# Altium schematic sheet FPGA.SchDoc: Cypress Molson - FPGA's
size B; ApprovedBy: G. Cosens; CheckedBy: G.Cosens; Author: G. Cosens; CompanyName: Linear Systems Ltd.; DrawnBy: G. Cosens; Engineer: G. Cosens; Organization: Linear Systems Ltd.; Address1: 1717 Dublin Avenue, Unit 1; Address2: Winnipeg, MB, Canada; Address3: R3H 0H2; DocumentNumber: LS7652; Revision: 1; SheetNumber: 03; SheetTotal: 12
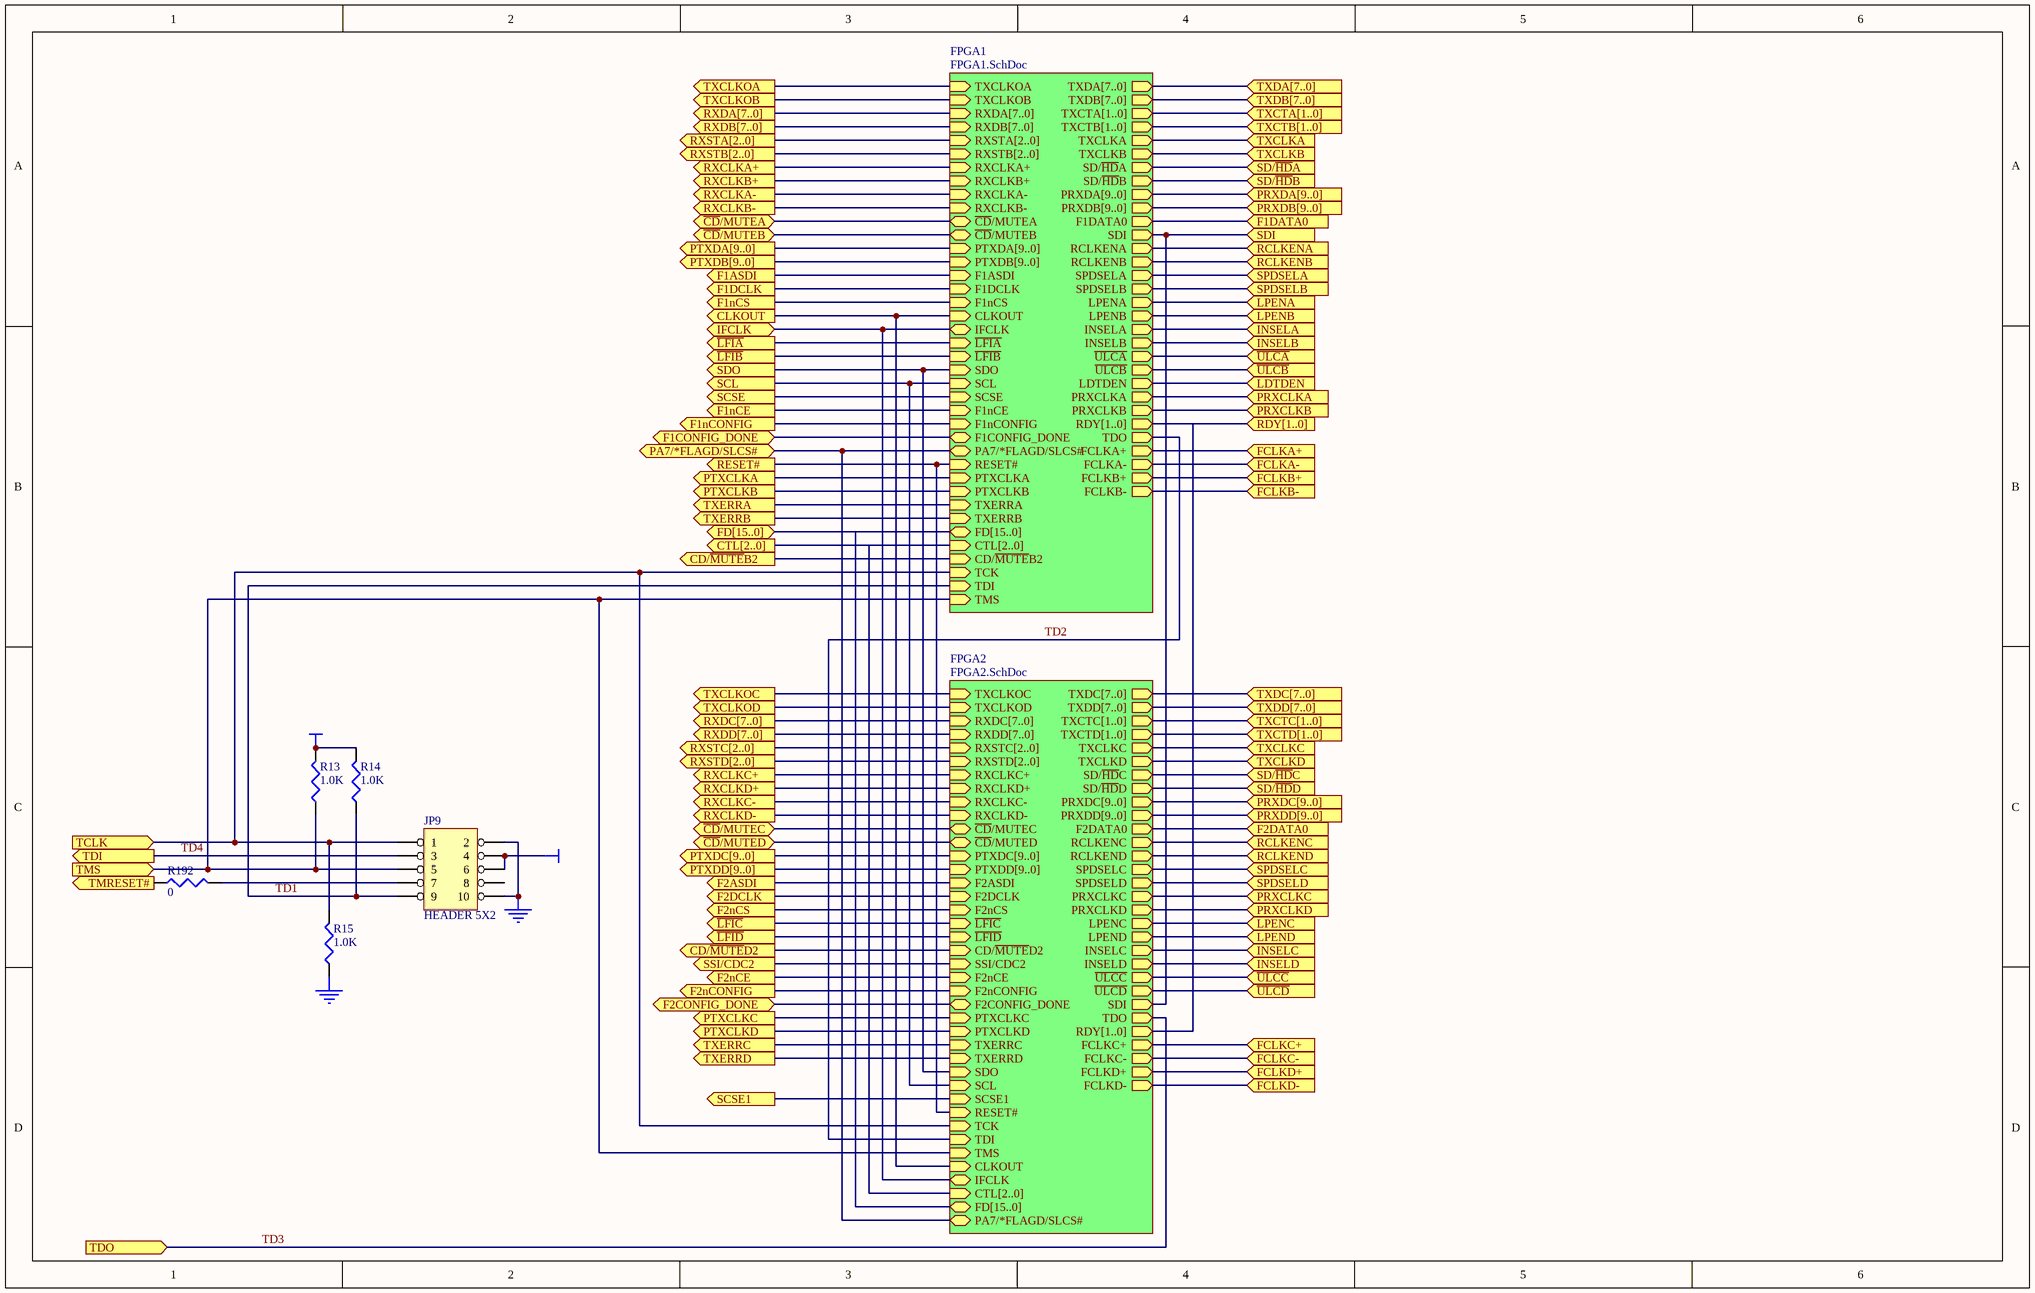
[diagram p0: FPGA.SchDoc]

## Parts
JP9  (no value)  [2X5PIN]
R13  1.0K  [0603]
R14  1.0K  [0603]
R15  1.0K  [0603]
R192  0  [0603]

## Sub-sheets
FPGA1 = FPGA1.SchDoc: TXDA[7..0] (out), TXDB[7..0] (out), TXCTA[1..0] (out), TXCTB[1..0] (out), TXCLKOA (in), TXCLKOB (in), TXCLKA (out), TXCLKB (out), RXDA[7..0] (in), RXDB[7..0] (in), RXSTA[2..0] (in), RXSTB[2..0] (in), RXCLKA+ (in), RXCLKB+ (in), RXCLKA- (in), RXCLKB- (in), SD/~{HD}A (out), SD/~{HD}B (out), ~{CD}/MUTEA (bidir), ~{CD}/MUTEB (bidir), PTXDA[9..0] (in), PTXDB[9..0] (in), PRXDA[9..0] (out), PRXDB[9..0] (out), F1DATA0 (out), F1ASDI (in), F1DCLK (in), F1nCS (in), CLKOUT (in), IFCLK (bidir), ~{LFIA} (in), ~{LFIB} (in), SDI (out), SDO (in), SCL (in), SCSE (in), F1nCE (in), F1nCONFIG (in), F1CONFIG_DONE (bidir), PA7/*FLAGD/SLCS# (bidir), RESET# (in), RCLKENA (out), RCLKENB (out), SPDSELA (out), SPDSELB (out), LPENA (out), LPENB (out), INSELA (out), INSELB (out), ~{ULCA} (out), ~{ULCB} (out), LDTDEN (out), PTXCLKA (in), PTXCLKB (in), PRXCLKA (out), PRXCLKB (out), FD[15..0] (bidir), CTL[2..0] (in), RDY[1..0] (out), CD/~{MUTE}B2 (in), TCK (in), TDI (in), TMS (in), TDO (out), TXERRA (in), TXERRB (in), FCLKA+ (out), FCLKA- (out), FCLKB+ (out), FCLKB- (out)
FPGA2 = FPGA2.SchDoc: TXDC[7..0] (out), TXDD[7..0] (out), TXCTC[1..0] (out), TXCTD[1..0] (out), TXCLKOC (in), TXCLKOD (in), TXCLKC (out), TXCLKD (out), RXDC[7..0] (in), RXDD[7..0] (in), RXSTC[2..0] (in), RXSTD[2..0] (in), RXCLKC+ (in), RXCLKD+ (in), RXCLKC- (in), RXCLKD- (in), SD/~{HD}C (out), SD/~{HD}D (out), ~{CD}/MUTEC (bidir), ~{CD}/MUTED (bidir), PTXDC[9..0] (in), PTXDD[9..0] (in), PRXDC[9..0] (out), PRXDD[9..0] (out), F2DATA0 (out), F2ASDI (in), F2DCLK (in), F2nCS (in), ~{LFIC} (in), ~{LFID} (in), CD/~{MUTE}D2 (in), SSI/CDC2 (in), F2nCE (in), F2nCONFIG (in), F2CONFIG_DONE (bidir), RCLKENC (out), RCLKEND (out), SPDSELC (out), SPDSELD (out), PTXCLKC (in), PRXCLKC (out), PTXCLKD (in), PRXCLKD (out), LPENC (out), LPEND (out), INSELC (out), INSELD (out), ~{ULCC} (out), ~{ULCD} (out), SDI (out), SDO (in), SCL (in), SCSE1 (in), RESET# (in), TCK (in), TDI (in), TMS (in), TDO (out), CLKOUT (in), IFCLK (bidir), RDY[1..0] (out), CTL[2..0] (in), FD[15..0] (bidir), PA7/*FLAGD/SLCS# (bidir), TXERRC (in), TXERRD (in), FCLKC+ (out), FCLKC- (out), FCLKD+ (out), FCLKD- (out)

## Ports
CD/~{MUTE}B2 (out), CD/~{MUTE}D2 (out), CLKOUT (out), CTL[2..0] (out), F1ASDI (out), F1CONFIG_DONE (bidir), F1DATA0 (in), F1DCLK (out), F1nCE (out), F1nCONFIG (out), F1nCS (out), F2ASDI (out), F2CONFIG_DONE (bidir), F2DATA0 (in), F2DCLK (out), F2nCE (out), F2nCONFIG (out), F2nCS (out), FCLKA+ (in), FCLKA- (in), FCLKB+ (in), FCLKB- (in), FCLKC+ (in), FCLKC- (in), FCLKD+ (in), FCLKD- (in), FD[15..0] (bidir), IFCLK (bidir), INSELA (in), INSELB (in), INSELC (in), INSELD (in), LDTDEN (in), LPENA (in), LPENB (in), LPENC (in), LPEND (in), PA7/*FLAGD/SLCS# (bidir), PRXCLKA (in), PRXCLKB (in), PRXCLKC (in), PRXCLKD (in), PRXDA[9..0] (in), PRXDB[9..0] (in), PRXDC[9..0] (in), PRXDD[9..0] (in), PTXCLKA (out), PTXCLKB (out), PTXCLKC (out), PTXCLKD (out), PTXDA[9..0] (out), PTXDB[9..0] (out), PTXDC[9..0] (out), PTXDD[9..0] (out), RCLKENA (in), RCLKENB (in), RCLKENC (in), RCLKEND (in), RDY[1..0] (in), RESET# (out), RXCLKA+ (out), RXCLKA- (out), RXCLKB+ (out), RXCLKB- (out), RXCLKC+ (out), RXCLKC- (out), RXCLKD+ (out), RXCLKD- (out), RXDA[7..0] (out), RXDB[7..0] (out), RXDC[7..0] (out), RXDD[7..0] (out), RXSTA[2..0] (out), RXSTB[2..0] (out), RXSTC[2..0] (out), RXSTD[2..0] (out), SCL (out), SCSE1 (out), SCSE (out), SD/~{HD}A (in), SD/~{HD}B (in), SD/~{HD}C (in), SD/~{HD}D (in), SDI (in), SDO (out), SPDSELA (in), SPDSELB (in), SPDSELC (in), SPDSELD (in), SSI/CDC2 (out), TCLK (in), TDI (out), TDO (in), TMRESET# (in), TMS (in), TXCLKA (in), TXCLKB (in), TXCLKC (in), TXCLKD (in), TXCLKOA (out), TXCLKOB (out), TXCLKOC (out), TXCLKOD (out), TXCTA[1..0] (in), TXCTB[1..0] (in), TXCTC[1..0] (in), TXCTD[1..0] (in), TXDA[7..0] (in), TXDB[7..0] (in), TXDC[7..0] (in), TXDD[7..0] (in), TXERRA (out), TXERRB (out), TXERRC (out), TXERRD (out), ~{CD}/MUTEA (bidir), ~{CD}/MUTEB (bidir), ~{CD}/MUTEC (bidir), ~{CD}/MUTED (bidir), ~{LFIA} (out), ~{LFIB} (out), ~{LFIC} (out), ~{LFID} (out), ~{ULCA} (in), ~{ULCB} (in), ~{ULCC} (in), ~{ULCD} (in)

## Nets
+3.3V: JP9.4 JP9.6 R13.2 R14.2
GND: JP9.2 JP9.10 R15.1
~{CD}/MUTEA: port ~{CD}/MUTEA, sheet FPGA1/~{CD}/MUTEA
~{CD}/MUTEB: port ~{CD}/MUTEB, sheet FPGA1/~{CD}/MUTEB
~{CD}/MUTEC: port ~{CD}/MUTEC, sheet FPGA2/~{CD}/MUTEC
~{CD}/MUTED: port ~{CD}/MUTED, sheet FPGA2/~{CD}/MUTED
CD/~{MUTE}B2: port CD/~{MUTE}B2, sheet FPGA1/CD/~{MUTE}B2
CD/~{MUTE}D2: port CD/~{MUTE}D2, sheet FPGA2/CD/~{MUTE}D2
CLKOUT: port CLKOUT, sheet FPGA1/CLKOUT, sheet FPGA2/CLKOUT
F1ASDI: port F1ASDI, sheet FPGA1/F1ASDI
F1CONFIG_DONE: port F1CONFIG_DONE, sheet FPGA1/F1CONFIG_DONE
F1DATA0: port F1DATA0, sheet FPGA1/F1DATA0
F1DCLK: port F1DCLK, sheet FPGA1/F1DCLK
F1nCE: port F1nCE, sheet FPGA1/F1nCE
F1nCONFIG: port F1nCONFIG, sheet FPGA1/F1nCONFIG
F1nCS: port F1nCS, sheet FPGA1/F1nCS
F2ASDI: port F2ASDI, sheet FPGA2/F2ASDI
F2CONFIG_DONE: port F2CONFIG_DONE, sheet FPGA2/F2CONFIG_DONE
F2DATA0: port F2DATA0, sheet FPGA2/F2DATA0
F2DCLK: port F2DCLK, sheet FPGA2/F2DCLK
F2nCE: port F2nCE, sheet FPGA2/F2nCE
F2nCONFIG: port F2nCONFIG, sheet FPGA2/F2nCONFIG
F2nCS: port F2nCS, sheet FPGA2/F2nCS
FCLKA+: port FCLKA+, sheet FPGA1/FCLKA+
FCLKA-: port FCLKA-, sheet FPGA1/FCLKA-
FCLKB+: port FCLKB+, sheet FPGA1/FCLKB+
FCLKB-: port FCLKB-, sheet FPGA1/FCLKB-
FCLKC+: port FCLKC+, sheet FPGA2/FCLKC+
FCLKC-: port FCLKC-, sheet FPGA2/FCLKC-
FCLKD+: port FCLKD+, sheet FPGA2/FCLKD+
FCLKD-: port FCLKD-, sheet FPGA2/FCLKD-
IFCLK: port IFCLK, sheet FPGA1/IFCLK, sheet FPGA2/IFCLK
INSELA: port INSELA, sheet FPGA1/INSELA
INSELB: port INSELB, sheet FPGA1/INSELB
INSELC: port INSELC, sheet FPGA2/INSELC
INSELD: port INSELD, sheet FPGA2/INSELD
~{LFIA}: port ~{LFIA}, sheet FPGA1/~{LFIA}
~{LFIB}: port ~{LFIB}, sheet FPGA1/~{LFIB}
~{LFIC}: port ~{LFIC}, sheet FPGA2/~{LFIC}
~{LFID}: port ~{LFID}, sheet FPGA2/~{LFID}
LDTDEN: port LDTDEN, sheet FPGA1/LDTDEN
LPENA: port LPENA, sheet FPGA1/LPENA
LPENB: port LPENB, sheet FPGA1/LPENB
LPENC: port LPENC, sheet FPGA2/LPENC
LPEND: port LPEND, sheet FPGA2/LPEND
PA7/*FLAGD/SLCS#: port PA7/*FLAGD/SLCS#, sheet FPGA1/PA7/*FLAGD/SLCS#, sheet FPGA2/PA7/*FLAGD/SLCS#
PRXCLKA: port PRXCLKA, sheet FPGA1/PRXCLKA
PRXCLKB: port PRXCLKB, sheet FPGA1/PRXCLKB
PRXCLKC: port PRXCLKC, sheet FPGA2/PRXCLKC
PRXCLKD: port PRXCLKD, sheet FPGA2/PRXCLKD
PTXCLKA: port PTXCLKA, sheet FPGA1/PTXCLKA
PTXCLKB: port PTXCLKB, sheet FPGA1/PTXCLKB
PTXCLKC: port PTXCLKC, sheet FPGA2/PTXCLKC
PTXCLKD: port PTXCLKD, sheet FPGA2/PTXCLKD
RCLKENA: port RCLKENA, sheet FPGA1/RCLKENA
RCLKENB: port RCLKENB, sheet FPGA1/RCLKENB
RCLKENC: port RCLKENC, sheet FPGA2/RCLKENC
RCLKEND: port RCLKEND, sheet FPGA2/RCLKEND
RESET#: port RESET#, sheet FPGA1/RESET#, sheet FPGA2/RESET#
RXCLKA+: port RXCLKA+, sheet FPGA1/RXCLKA+
RXCLKA-: port RXCLKA-, sheet FPGA1/RXCLKA-
RXCLKB+: port RXCLKB+, sheet FPGA1/RXCLKB+
RXCLKB-: port RXCLKB-, sheet FPGA1/RXCLKB-
RXCLKC+: port RXCLKC+, sheet FPGA2/RXCLKC+
RXCLKC-: port RXCLKC-, sheet FPGA2/RXCLKC-
RXCLKD+: port RXCLKD+, sheet FPGA2/RXCLKD+
RXCLKD-: port RXCLKD-, sheet FPGA2/RXCLKD-
SCL: port SCL, sheet FPGA1/SCL, sheet FPGA2/SCL
SCSE: port SCSE, sheet FPGA1/SCSE
SCSE1: port SCSE1, sheet FPGA2/SCSE1
SD/~{HD}A: port SD/~{HD}A, sheet FPGA1/SD/~{HD}A
SD/~{HD}B: port SD/~{HD}B, sheet FPGA1/SD/~{HD}B
SD/~{HD}C: port SD/~{HD}C, sheet FPGA2/SD/~{HD}C
SD/~{HD}D: port SD/~{HD}D, sheet FPGA2/SD/~{HD}D
SDI: port SDI, sheet FPGA1/SDI, sheet FPGA2/SDI
SDO: port SDO, sheet FPGA1/SDO, sheet FPGA2/SDO
SPDSELA: port SPDSELA, sheet FPGA1/SPDSELA
SPDSELB: port SPDSELB, sheet FPGA1/SPDSELB
SPDSELC: port SPDSELC, sheet FPGA2/SPDSELC
SPDSELD: port SPDSELD, sheet FPGA2/SPDSELD
SSI/CDC2: port SSI/CDC2, sheet FPGA2/SSI/CDC2
TCLK: JP9.1 R15.2 ; port TCLK, sheet FPGA1/TCK, sheet FPGA2/TCK
TD1: JP9.9 R14.1 ; sheet FPGA1/TDI
TD2: sheet FPGA1/TDO, sheet FPGA2/TDI
TD3: port TDO, sheet FPGA2/TDO
TD4: JP9.3 ; port TDI
TMRESET#: R192.1 ; port TMRESET#
TMS: JP9.5 R13.1 ; port TMS, sheet FPGA1/TMS, sheet FPGA2/TMS
TXCLKA: port TXCLKA, sheet FPGA1/TXCLKA
TXCLKB: port TXCLKB, sheet FPGA1/TXCLKB
TXCLKC: port TXCLKC, sheet FPGA2/TXCLKC
TXCLKD: port TXCLKD, sheet FPGA2/TXCLKD
TXCLKOA: port TXCLKOA, sheet FPGA1/TXCLKOA
TXCLKOB: port TXCLKOB, sheet FPGA1/TXCLKOB
TXCLKOC: port TXCLKOC, sheet FPGA2/TXCLKOC
TXCLKOD: port TXCLKOD, sheet FPGA2/TXCLKOD
TXERRA: port TXERRA, sheet FPGA1/TXERRA
TXERRB: port TXERRB, sheet FPGA1/TXERRB
TXERRC: port TXERRC, sheet FPGA2/TXERRC
TXERRD: port TXERRD, sheet FPGA2/TXERRD
~{ULCA}: port ~{ULCA}, sheet FPGA1/~{ULCA}
~{ULCB}: port ~{ULCB}, sheet FPGA1/~{ULCB}
~{ULCC}: port ~{ULCC}, sheet FPGA2/~{ULCC}
~{ULCD}: port ~{ULCD}, sheet FPGA2/~{ULCD}
NetJP9_7: JP9.7 R192.2

Not connected (* = marked no-connect by the designer): JP9 8

## Buses and harness runs
bus port CTL[2..0] = sheet FPGA1/CTL[2..0] = sheet FPGA2/CTL[2..0]
bus port FD[15..0] = sheet FPGA1/FD[15..0] = sheet FPGA2/FD[15..0]
bus port PRXDA[9..0] = sheet FPGA1/PRXDA[9..0]
bus port PRXDB[9..0] = sheet FPGA1/PRXDB[9..0]
bus port PRXDC[9..0] = sheet FPGA2/PRXDC[9..0]
bus port PRXDD[9..0] = sheet FPGA2/PRXDD[9..0]
bus port PTXDA[9..0] = sheet FPGA1/PTXDA[9..0]
bus port PTXDB[9..0] = sheet FPGA1/PTXDB[9..0]
bus port PTXDC[9..0] = sheet FPGA2/PTXDC[9..0]
bus port PTXDD[9..0] = sheet FPGA2/PTXDD[9..0]
bus port RDY[1..0] = sheet FPGA1/RDY[1..0] = sheet FPGA2/RDY[1..0]
bus port RXDA[7..0] = sheet FPGA1/RXDA[7..0]
bus port RXDB[7..0] = sheet FPGA1/RXDB[7..0]
bus port RXDC[7..0] = sheet FPGA2/RXDC[7..0]
bus port RXDD[7..0] = sheet FPGA2/RXDD[7..0]
bus port RXSTA[2..0] = sheet FPGA1/RXSTA[2..0]
bus port RXSTB[2..0] = sheet FPGA1/RXSTB[2..0]
bus port RXSTC[2..0] = sheet FPGA2/RXSTC[2..0]
bus port RXSTD[2..0] = sheet FPGA2/RXSTD[2..0]
bus port TXCTA[1..0] = sheet FPGA1/TXCTA[1..0]
bus port TXCTB[1..0] = sheet FPGA1/TXCTB[1..0]
bus port TXCTC[1..0] = sheet FPGA2/TXCTC[1..0]
bus port TXCTD[1..0] = sheet FPGA2/TXCTD[1..0]
bus port TXDA[7..0] = sheet FPGA1/TXDA[7..0]
bus port TXDB[7..0] = sheet FPGA1/TXDB[7..0]
bus port TXDC[7..0] = sheet FPGA2/TXDC[7..0]
bus port TXDD[7..0] = sheet FPGA2/TXDD[7..0]

## Notes on the sheet
- Size
- Date:
- B
- Drawing Number
- Sheet
- Revision
- of
- File:
- Drawn By:
- G. Cosens

## Library data of the parts
JP9 = HEADER 5X2: Text Field1: 40; Text Field2: 60
R13-R15 R192 = RES1